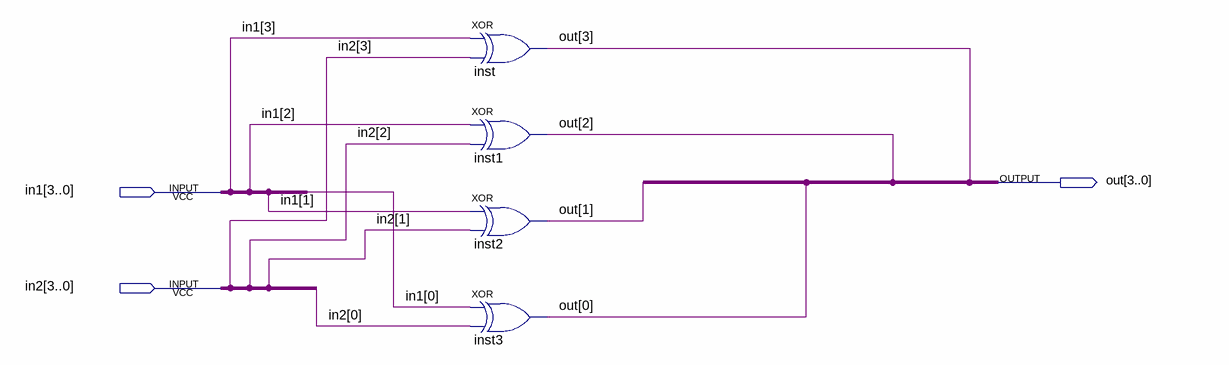
[diagram p0: schematic sheet]
// Quartus schematic 4bitxor.bdf as structural Verilog: 4 symbols, 3 pins
module \4bitxor  (
  input  [3:0] in1,
  input  [3:0] in2,
  output [3:0] out
);

  xor inst (out[3], in1[3], in2[3]);
  xor inst1 (out[2], in1[2], in2[2]);
  xor inst2 (out[1], in1[1], in2[1]);
  xor inst3 (out[0], in1[0], in2[0]);
endmodule
